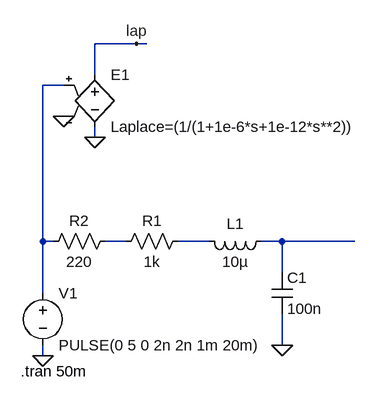
[diagram p0: schematic RC_pulseshape.asc]
RC_pulseshape.asc, the LTspice schematic file:
Version 4
SHEET 1 880 680
WIRE 192 -240 128 -240
WIRE 208 -240 192 -240
WIRE 128 -192 128 -240
WIRE 80 -176 48 -176
WIRE 128 -96 128 -112
WIRE 48 64 48 -176
WIRE 64 64 48 64
WIRE 176 64 144 64
WIRE 304 64 256 64
WIRE 416 64 384 64
WIRE 528 64 416 64
WIRE 416 112 416 64
WIRE 48 144 48 64
WIRE 416 224 416 176
WIRE 48 240 48 224
FLAG 48 240 0
FLAG 416 224 0
FLAG 128 -96 0
FLAG 80 -128 0
FLAG 192 -240 lap
SYMBOL voltage 48 128 R0
WINDOW 123 0 0 Left 2
WINDOW 39 0 0 Left 2
SYMATTR InstName V1
SYMATTR Value PULSE(0 5 0 2n 2n 1m 20m)
SYMBOL res 272 48 R90
WINDOW 0 0 56 VBottom 2
WINDOW 3 32 56 VTop 2
SYMATTR InstName R1
SYMATTR Value 1k
SYMBOL ind 400 48 R90
WINDOW 0 5 56 VBottom 2
WINDOW 3 32 56 VTop 2
SYMATTR InstName L1
SYMATTR Value 10µ
SYMBOL cap 400 112 R0
SYMATTR InstName C1
SYMATTR Value 100n
SYMBOL res 160 48 R90
WINDOW 0 0 56 VBottom 2
WINDOW 3 32 56 VTop 2
SYMATTR InstName R2
SYMATTR Value 220
SYMBOL e 128 -208 R0
SYMATTR InstName E1
SYMATTR Value Laplace=(1/(1+1e-6*s+1e-12*s**2))
TEXT 14 264 Left 2 !.tran 50m

The netlist it stands for:
* RC_pulseshape.asc
V1 N001 0 PULSE(0 5 0 2n 2n 1m 20m)
R1 N003 N002 1k
L1 N004 N003 10µ
C1 N004 0 100n
R2 N002 N001 220
E1 lap 0 N001 0 Laplace=(1/(1+1e-6*s+1e-12*s**2))
.tran 50m
.backanno
.end